# EAGLE design BT (EAGLE 6.4)
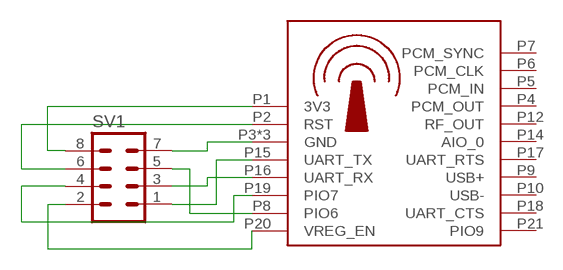
[diagram p0: schematic, sheet 1]

## Parts
BT1  ARDEUNIS_BT_787  [BT_MODULE]
SV1  MA04-2  [MA04-2]

## Nets
N$1: BT1.P16(UART_RX) SV1.3
N$2: BT1.P15(UART_TX) SV1.1
N$3: BT1.P2(RST) SV1.6
N$4: BT1.P3(GND) BT1.P11(GND) BT1.P13(GND) SV1.7
N$5: BT1.P1(3V3) SV1.8
N$6: BT1.P8(PIO6) SV1.5
N$7: BT1.P19(PIO7) SV1.4
N$8: BT1.P20(VREG_EN) SV1.2
Unconnected: BT1.P4(PCM_OUT) BT1.P5(PCM_IN) BT1.P6(PCM_CLK) BT1.P7(PCM_SYNC) BT1.P9(USB+) BT1.P10(USB-) BT1.P12(RF_OUT) BT1.P14(AIO_0) BT1.P17(UART_RTS) BT1.P18(UART_CTS) BT1.P21(PIO9)

## Library data of the parts
BT1 = tinyLight:ARDEUNIS_BT_787
SV1 = con-lstb:MA04-2: PIN HEADER; OC_FARNELL: unknown; OC_NEWARK: unknown

## Board
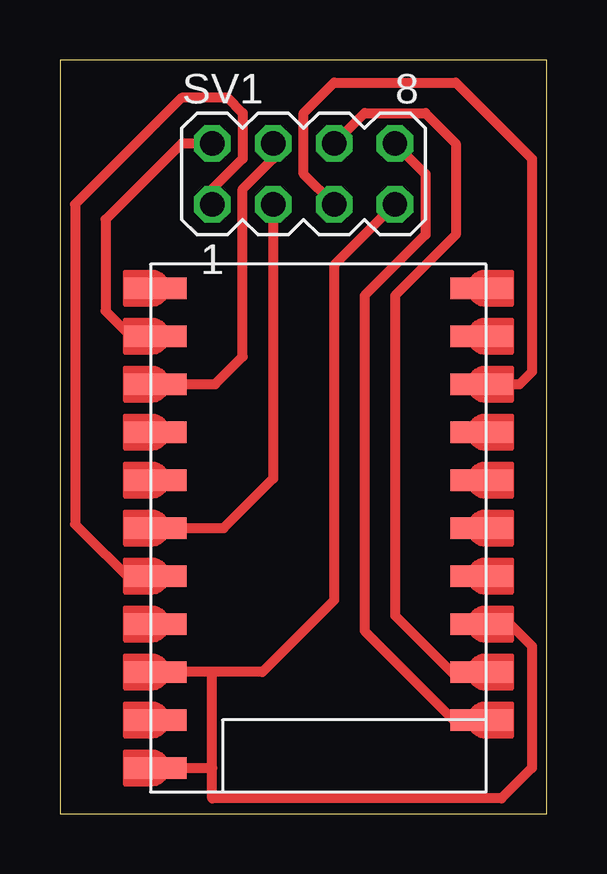
[diagram p1: board, top side]

Size 20.3 x 31.42 mm. Coordinates in mm from the lower left corner, seen from the top.
Outline: 0,0 20.3,0 20.3,31.42 0,31.42 0,0
Copper layers (1*16): Top 0.035mm / dielectric 1.5mm / Bottom 0.035mm
Design rules "default": minimum track width 10mil, minimum drill 24mil, track to track 8mil, track to pad 8mil, pad to pad 8mil, via to via 8mil, smd to smd 8mil, copper to edge 40mil, drill to drill 8mil, minimum pad ring 10mil, minimum via ring 8mil, stop-mask expansion 4mil, vias tented up to drill 0mil, thermal gap 10mil

### Footprints (pad centres in the part's own frame; a part is rotated, then mirrored left to right if it is on the bottom)
BT_MODULE = smd 2.6 x 0.9: P1 0.2,-2; P2 0.2,-4; P3 0.2,-6; P4 0.2,-8; P5 0.2,-10; P6 0.2,-12; P7 0.2,-14; P8 0.2,-16; P9 0.2,-18; P10 0.2,-20; P11 13.8,0; P12 13.8,-2; P13 13.8,-4; P14 13.8,-6; P15 13.8,-8; P16 13.8,-10; P17 13.8,-12; P18 13.8,-14; P19 13.8,-16; P20 13.8,-18; P21 13.8,-20
MA04-2 = drill 1.016 octagon: 1 -3.81,-1.27; 2 -3.81,1.27; 3 -1.27,-1.27; 4 -1.27,1.27; 5 1.27,-1.27; 6 1.27,1.27; 7 3.81,-1.27; 8 3.81,1.27

### Placement (x,y rotation side)
BT1  17.78,1.91 180 top
SV1  10.16,26.67 0 top

### Tracks (layer width: path | path; a pad name or v marks a point on that pad's centre or on a via)
N$1
  Top 0.406: SV1.3 8.89,13.97 6.83,11.9 BT1.P16
N$2
  Top 0.406: BT1.P15 3.6,9.53 3.17,9.53 0.64,12.06 0.64,25.4 5.08,29.84 6.99,29.84 7.62,29.21 7.62,27.3 6.35,26.04 SV1.1
N$3
  Top 0.406: SV1.6 12.7,29.21 15.24,29.21 16.51,27.94 16.51,24.13 13.97,21.59 13.97,8.26 16.51,5.71 17.39,5.71 BT1.P2
N$4
  Top 0.406: SV1.7 11.43,22.86 11.43,8.89 8.45,5.91 6.35,5.91 | 6.35,5.91 BT1.P13 | BT1.P11 6.35,1.91 | 6.35,1.91 6.35,5.91 | 6.35,1.91 6.35,0.64 18.41,0.64 19.68,1.91 19.68,6.99 18.77,7.91 BT1.P3
N$5
  Top 0.406: SV1.8 15.24,26.67 15.24,24.13 12.7,21.59 12.7,7.62 16.41,3.9 BT1.P1
N$6
  Top 0.406: SV1.5 10.16,26.67 10.16,29.21 11.43,30.48 16.51,30.48 19.68,27.3 19.68,18.41 19.18,17.91 BT1.P8
N$7
  Top 0.406: SV1.4 8.89,27.3 7.62,26.04 7.62,19.05 6.47,17.91 BT1.P19
N$8
  Top 0.406: SV1.2 5.08,27.94 1.91,24.77 1.91,20.95 3.17,19.68 3.76,19.68 BT1.P20